# EAGLE schematic Main (EAGLE 9.2.2)
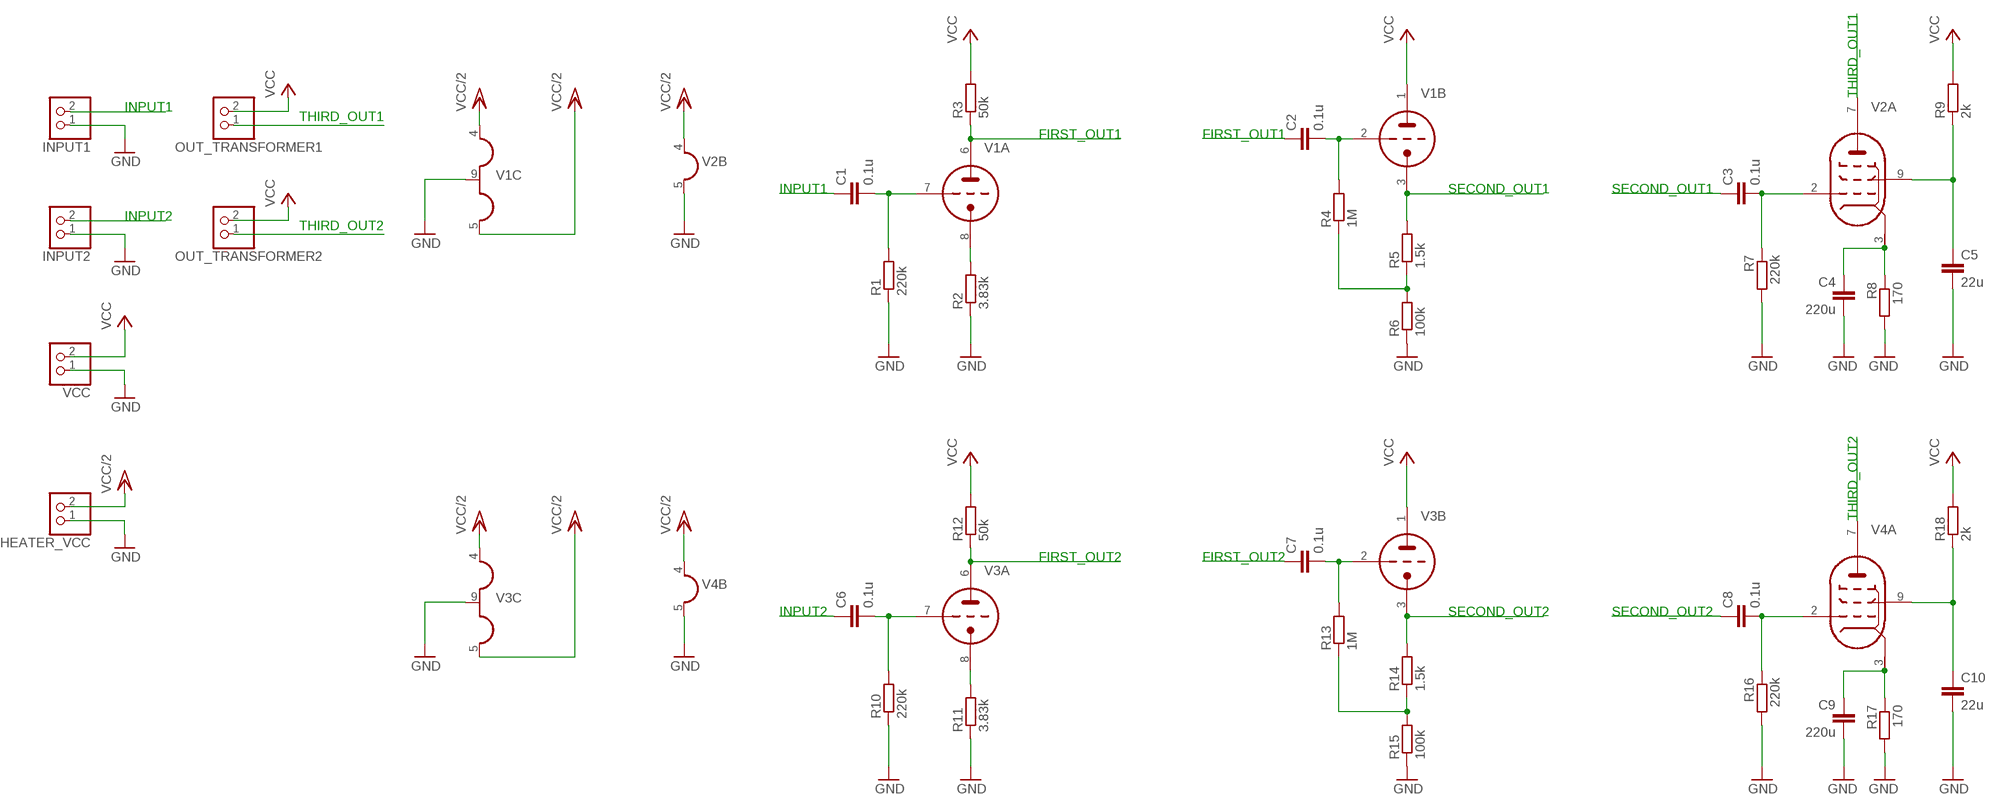
[diagram p0: schematic, sheet 1]

## Parts
C1  0.1u  C  [C025-025X050]
C2  0.1u  C  [C025-025X050]
C3  0.1u  C  [C025-025X050]
C4  220u  C  [C025-025X050]
C5  22u  C  [C025-025X050]
C6  0.1u  C  [C025-025X050]
C7  0.1u  C  [C025-025X050]
C8  0.1u  C  [C025-025X050]
C9  220u  C  [C025-025X050]
C10  22u  C  [C025-025X050]
HEATER_VCC  PINHD-1X2  [1X02]
INPUT1  PINHD-1X2  [1X02]
INPUT2  PINHD-1X2  [1X02]
OUT_TRANSFORMER1  PINHD-1X2  [1X02]
OUT_TRANSFORMER2  PINHD-1X2  [1X02]
R1  220k  RESISTOR2  [0207/7]
R2  3.83k  RESISTOR2  [0207/7]
R3  50k  RESISTOR2  [0207/7]
R4  1M  RESISTOR2  [0207/7]
R5  1.5k  RESISTOR2  [0207/7]
R6  100k  RESISTOR2  [0207/7]
R7  220k  RESISTOR2  [0207/7]
R8  170  RESISTOR2  [0207/7]
R9  2k  RESISTOR2  [0207/7]
R10  220k  RESISTOR2  [0207/7]
R11  3.83k  RESISTOR2  [0207/7]
R12  50k  RESISTOR2  [0207/7]
R13  1M  RESISTOR2  [0207/7]
R14  1.5k  RESISTOR2  [0207/7]
R15  100k  RESISTOR2  [0207/7]
R16  220k  RESISTOR2  [0207/7]
R17  170  RESISTOR2  [0207/7]
R18  2k  RESISTOR2  [0207/7]
V1  AT-MT9P(12AX7)  [AT-MT9P]
V2  AT-MT9P(6BQ5)  [AT-MT9P]
V3  AT-MT9P(12AX7)  [AT-MT9P]
V4  AT-MT9P(6BQ5)  [AT-MT9P]
VCC  PINHD-1X2  [1X02]

## Nets
GND: C4.2 C5.2 C9.2 C10.2 HEATER_VCC.1 INPUT1.1 INPUT2.1 R1.1 R2.1 R6.1 R7.2 R8.2 R10.1 R11.1 R15.1 R16.2 R17.2 V1.9(C:H2) V2.5(B:H2) V3.9(C:H2) V4.5(B:H2) VCC.1
N$1: R3.1 V1.6(A:TA)
N$2: R2.2 V1.8(A:TK)
N$3: INPUT2.2
N$4: INPUT1.2
N$5: C1.2 R1.2 V1.7(A:TG)
N$6: R5.2 V1.3(B:TK)
N$7: C1.1
N$8: R4.1 R5.1 R6.2
N$9: C2.2 R4.2 V1.2(B:TG)
N$10: C2.1
N$11: V1.5(C:H3) V3.5(C:H3) ; supply symbol labelled VCC/2
N$12: C3.1
N$13: C3.2 R7.1 V2.2(A:PG)
N$14: C4.1 R8.1 V2.3(A:PK)
N$15: V2.7(A:PA)
N$16: OUT_TRANSFORMER1.1
N$17: C5.1 R9.1 V2.9(A:PSG)
N$18: OUT_TRANSFORMER2.1
N$19: R12.1 V3.6(A:TA)
N$20: R11.2 V3.8(A:TK)
N$21: C6.2 R10.2 V3.7(A:TG)
N$22: C6.1
N$23: R14.2 V3.3(B:TK)
N$24: R13.1 R14.1 R15.2
N$25: C7.2 R13.2 V3.2(B:TG)
N$26: C7.1
N$27: C8.1
N$28: C8.2 R16.1 V4.2(A:PG)
N$29: C9.1 R17.1 V4.3(A:PK)
N$30: V4.7(A:PA)
N$31: C10.1 R18.1 V4.9(A:PSG)
VCC: OUT_TRANSFORMER1.2 OUT_TRANSFORMER2.2 R3.2 R9.2 R12.2 R18.2 V1.1(B:TA) V3.1(B:TA) VCC.2
VCC/2: HEATER_VCC.2 V1.4(C:H1) V2.4(B:H1) V3.4(C:H1) V4.4(B:H1)

## Notes on the sheet
- THIRD_OUT1
- INPUT1 | THIRD_OUT1
- FIRST_OUT1 | FIRST_OUT1
- INPUT1 | SECOND_OUT1 | SECOND_OUT1
- INPUT2 | THIRD_OUT2
- THIRD_OUT2
- FIRST_OUT2 | FIRST_OUT2
- INPUT2 | SECOND_OUT2 | SECOND_OUT2

## Library data of the parts
C1-C10 = VacuumTube:C
HEATER_VCC INPUT1 INPUT2 OUT_TRANSFORMER1 OUT_TRANSFORMER2 VCC = VacuumTube:PINHD-1X2: PIN HEADER
R1-R18 = VacuumTube:RESISTOR2
V1 V3 = VacuumTube:AT-MT9P(12AX7)
V2 V4 = VacuumTube:AT-MT9P(6BQ5)